# EAGLE design Pi_Servo_pHAT (EAGLE 9.4.2)
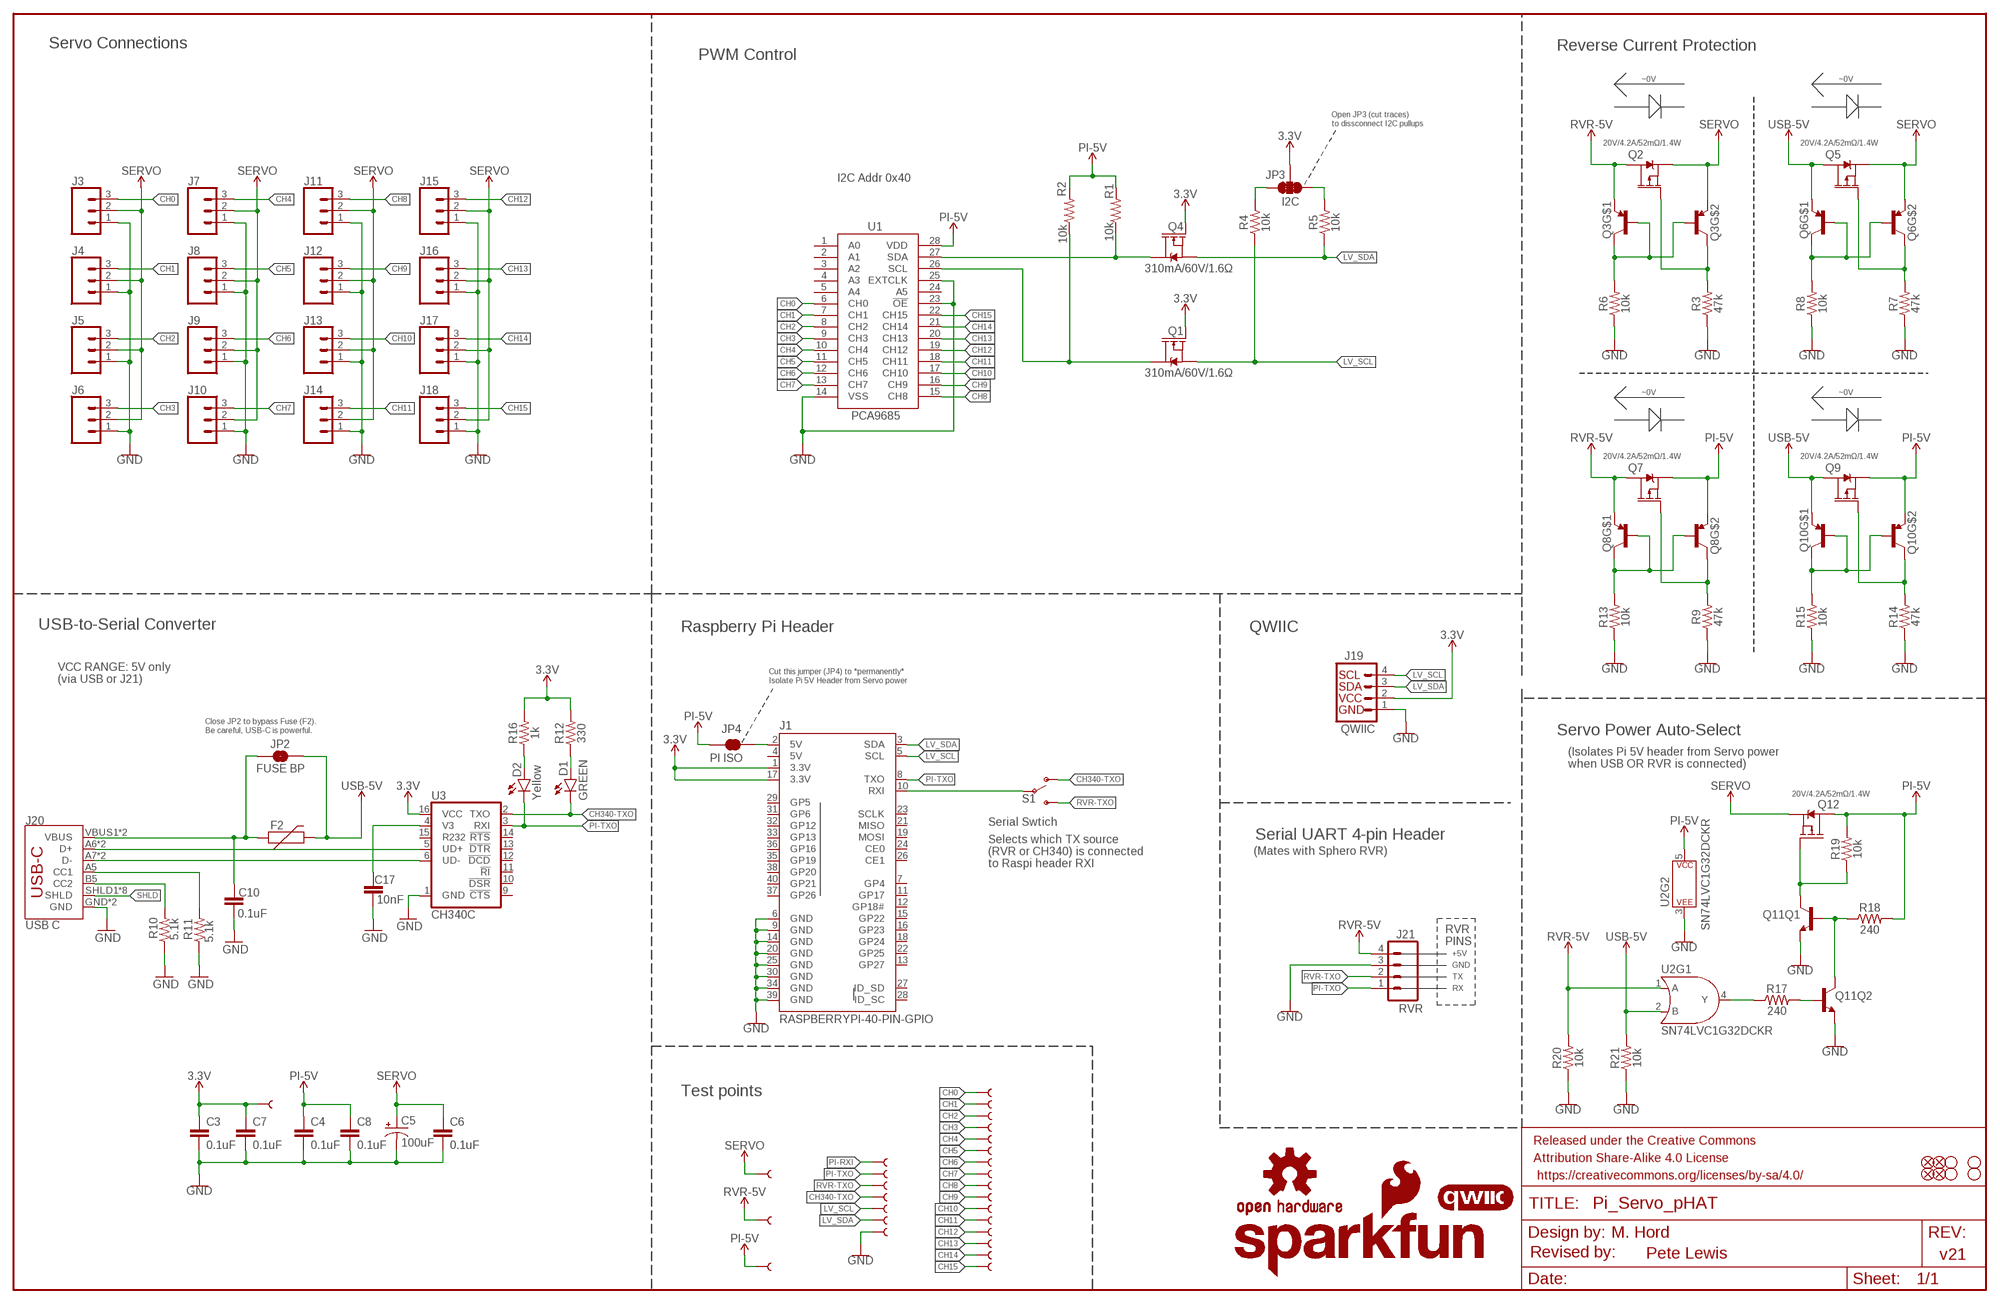
[diagram p0: schematic, sheet 1]

## Parts
C3  0.1uF  0.1UF-0603-25V-(+80/-20%)  [0603]
C4  0.1uF  0.1UF-0603-25V-(+80/-20%)  [0603]
C5  100uF  100UF-POLAR-25V-20%(ELEC)  [PANASONIC_D]
C6  0.1uF  0.1UF-0603-25V-(+80/-20%)  [0603]
C7  0.1uF  0.1UF-0603-25V-(+80/-20%)  [0603]
C8  0.1uF  0.1UF-0603-25V-(+80/-20%)  [0603]
C10  0.1uF  0.1UF-0603-25V-(+80/-20%)  [0603]
C17  10nF  10NF-0603-50V-10%  [0603]
D1  GREEN  LED-GREEN0603  [LED-0603]
D2  Yellow  LED-YELLOW0603  [LED-0603]
F2  16V/2.5A(5A TRIP)  PPTC_16V_2.5A  [1812]
FD1  FIDUCIALUFIDUCIAL  [FIDUCIAL-MICRO]
FD2  FIDUCIALUFIDUCIAL  [FIDUCIAL-MICRO]
FD3  FIDUCIALUFIDUCIAL  [FIDUCIAL-MICRO]
FD4  FIDUCIALUFIDUCIAL  [FIDUCIAL-MICRO]
FRAME2  FRAME-LEDGER  [CREATIVE_COMMONS]
H1  STAND-OFF  [STAND-OFF]
H2  STAND-OFF  [STAND-OFF]
H3  STAND-OFF  [STAND-OFF]
H4  STAND-OFF  [STAND-OFF]
J1  RASPBERRYPI-40-PIN-GPIO  RASPBERRYPI-40-PIN-GPIO_PTH_NO_SHROUD  [2X20]
J3  CONN_03  [1X03]
J4  CONN_03  [1X03]
J5  CONN_03  [1X03]
J6  CONN_03  [1X03]
J7  CONN_03  [1X03]
J8  CONN_03  [1X03]
J9  CONN_03  [1X03]
J10  CONN_03  [1X03]
J11  CONN_03  [1X03]
J12  CONN_03  [1X03]
J13  CONN_03  [1X03]
J14  CONN_03  [1X03]
J15  CONN_03  [1X03]
J16  CONN_03  [1X03]
J17  CONN_03  [1X03]
J18  CONN_03  [1X03]
J19  QWIIC  QWIIC_CONNECTORJS-1MM  [JST04_1MM_RA]
J20  USB C  USB_C16PIN  [USB-C-16P]
J21  RVR  CONN_04LOCK  [1X04_LOCK]
JP2  FUSE BP  JUMPER-SMT_2_NO_SILK  [SMT-JUMPER_2_NO_SILK]
JP3  I2C  JUMPER-SMT_3_2-NC_TRACE_SILK  [SMT-JUMPER_3_2-NC_TRACE_SILK]
JP4  PI ISO  JUMPER-SMT_2_NC_TRACE_SILK  [SMT-JUMPER_2_NC_TRACE_SILK]
LOGO1  SFE_LOGO_NAME_FLAME.1_INCH  [SFE_LOGO_NAME_FLAME_.1]
LOGO2  OSHW-LOGOS  [OSHW-LOGO-S]
Q1  310mA/60V/1.6Ω  MOSFET-NCH-2N7002PW  [SOT323]
Q2  20V/4.2A/52mΩ/1.4W  MOSFET_PCH-DMG2305UX-7  [SOT23-3]
Q3  TRANS_PNP_DUALSOT-363  [SOT363_PHILIPS]
Q4  310mA/60V/1.6Ω  MOSFET-NCH-2N7002PW  [SOT323]
Q5  20V/4.2A/52mΩ/1.4W  MOSFET_PCH-DMG2305UX-7  [SOT23-3]
Q6  TRANS_PNP_DUALSOT-363  [SOT363_PHILIPS]
Q7  20V/4.2A/52mΩ/1.4W  MOSFET_PCH-DMG2305UX-7  [SOT23-3]
Q8  TRANS_PNP_DUALSOT-363  [SOT363_PHILIPS]
Q9  20V/4.2A/52mΩ/1.4W  MOSFET_PCH-DMG2305UX-7  [SOT23-3]
Q10  TRANS_PNP_DUALSOT-363  [SOT363_PHILIPS]
Q11  TRANS_NPN_DUAL-MBT3904DW1T1  [SC70-6]
Q12  20V/4.2A/52mΩ/1.4W  MOSFET_PCH-DMG2305UX-7  [SOT23-3]
R1  10k  10KOHM-0603-1/10W-1%  [0603]
R2  10k  10KOHM-0603-1/10W-1%  [0603]
R3  47k  47KOHM-0603-1/10W-1%  [0603]
R4  10k  10KOHM-0603-1/10W-1%  [0603]
R5  10k  10KOHM-0603-1/10W-1%  [0603]
R6  10k  10KOHM-0603-1/10W-1%  [0603]
R7  47k  47KOHM-0603-1/10W-1%  [0603]
R8  10k  10KOHM-0603-1/10W-1%  [0603]
R9  47k  47KOHM-0603-1/10W-1%  [0603]
R10  5.1k  5.1KOHM5.1KOHM-0603-1/10W-1%  [0603]
R11  5.1k  5.1KOHM5.1KOHM-0603-1/10W-1%  [0603]
R12  330  330OHM-0603-1/10W-1%  [0603]
R13  10k  10KOHM-0603-1/10W-1%  [0603]
R14  47k  47KOHM-0603-1/10W-1%  [0603]
R15  10k  10KOHM-0603-1/10W-1%  [0603]
R16  1k  1KOHM-0603-1/10W-1%  [0603]
R17  240  240OHM-0603-1/10W-1%  [0603]
R18  240  240OHM-0603-1/10W-1%  [0603]
R19  10k  10KOHM-0603-1/10W-1%  [0603]
R20  10k  10KOHM-0603-1/10W-1%  [0603]
R21  10k  10KOHM-0603-1/10W-1%  [0603]
S1  SWITCH-SPDT-SMD-RIGHT-ANGLE  [SWITCH_SPST_SMD_A]
TP0  TEST-POINT3X4  [PAD.03X.04]
TP1  TEST-POINT3X4  [PAD.03X.04]
TP2  TEST-POINT3X4  [PAD.03X.04]
TP3  TEST-POINT3X4  [PAD.03X.04]
TP4  TEST-POINT3X4  [PAD.03X.04]
TP5  TEST-POINT3X4  [PAD.03X.04]
TP6  TEST-POINT3X4  [PAD.03X.04]
TP7  TEST-POINT3X4  [PAD.03X.04]
TP8  TEST-POINT3X4  [PAD.03X.04]
TP9  TEST-POINT3X4  [PAD.03X.04]
TP10  TEST-POINT3X4  [PAD.03X.04]
TP11  TEST-POINT3X4  [PAD.03X.04]
TP12  TEST-POINT3X4  [PAD.03X.04]
TP13  TEST-POINT3X4  [PAD.03X.04]
TP14  TEST-POINT3X4  [PAD.03X.04]
TP15  TEST-POINT3X4  [PAD.03X.04]
TP16  TEST-POINT3X4  [PAD.03X.04]
TP17  TEST-POINT3X4  [PAD.03X.04]
TP18  TEST-POINTTP_15TH_THRU  [TP_15TH]
TP19  TEST-POINTTP_15TH_THRU  [TP_15TH]
TP20  TEST-POINT3X4  [PAD.03X.04]
TP21  TEST-POINT3X4  [PAD.03X.04]
TP22  TEST-POINT3X4  [PAD.03X.04]
TP23  TEST-POINT3X4  [PAD.03X.04]
TP24  TEST-POINT3X4  [PAD.03X.04]
TP25  TEST-POINT3X4  [PAD.03X.04]
TP26  TEST-POINT3X4  [PAD.03X.04]
U1  PCA9685  [TSSOP-28_4MM]
U2  SN74LVC1G32DCKR  7432  [SOT353]
U3  CH340C  [SO016]
U$1  QWIIC_LOGO_5MM  [QWIIC_5MM]

## Nets
3.3V: C3.1 C7.1 J1.1(3.3V) J1.17(3.3V) J19.2 JP3.2 Q1.1(G) Q4.1(G) R12.2 R16.2 TP22.P$1 U3.16(VCC)
CC1: J20.A5(CC1) R11.2
CC2: J20.B5(CC2) R10.2
CH0: J3.3 TP0.P$1 U1.6(CH0)
CH1: J4.3 TP1.P$1 U1.7(CH1)
CH2: J5.3 TP2.P$1 U1.8(CH2)
CH3: J6.3 TP3.P$1 U1.9(CH3)
CH4: J7.3 TP4.P$1 U1.10(CH4)
CH5: J8.3 TP5.P$1 U1.11(CH5)
CH6: J9.3 TP6.P$1 U1.12(CH6)
CH7: J10.3 TP7.P$1 U1.13(CH7)
CH8: J11.3 TP8.P$1 U1.15(CH8)
CH9: J12.3 TP9.P$1 U1.16(CH9)
CH10: J13.3 TP10.P$1 U1.17(CH10)
CH11: J14.3 TP11.P$1 U1.18(CH11)
CH12: J15.3 TP12.P$1 U1.19(CH12)
CH13: J16.3 TP13.P$1 U1.20(CH13)
CH14: J17.3 TP14.P$1 U1.21(CH14)
CH15: J18.3 TP15.P$1 U1.22(CH15)
CH340-TXO: D1.C S1.1(O) TP23.P$1 U3.2(TXO)
D+: J20.A6(D+) J20.B6(D+) U3.5(UD+)
D-: J20.A7(D-) J20.B7(D-) U3.6(UD-)
GND: C3.2 C4.2 C5.- C6.2 C7.2 C8.2 C10.2 C17.2 J1.6(GND) J1.9(GND) J1.14(GND) J1.20(GND) J1.25(GND) J1.30(GND) J1.34(GND) J1.39(GND) J3.1 J4.1 J5.1 J6.1 J7.1 J8.1 J9.1 J10.1 J11.1 J12.1 J13.1 J14.1 J15.1 J16.1 J17.1 J18.1 J19.1 J20.GND J20.GND2(GND) J21.3 Q11.1(Q2:E) Q11.4(Q1:E) R3.1 R6.1 R7.1 R8.1 R9.1 R10.1 R11.1 R13.1 R14.1 R15.1 R20.1 R21.1 TP17.P$1 U1.14(VSS) U1.23(!OE) U1.25(EXTCLK) U2.3(P$V-) U3.1(GND)
LV_SCL: J1.5(SCL) J19.4 Q1.2(S) R4.1 TP18.P$1
LV_SDA: J1.3(SDA) J19.3 Q4.2(S) R5.1 TP19.P$1
N$1: Q5.1(G) Q6.3(C) R7.2
N$2: JP3.3 R4.2
N$3: Q1.3(D) R2.1 U1.26(SCL)
N$4: Q4.3(D) R1.1 U1.27(SDA)
N$5: JP3.1 R5.2
N$6: D2.A R16.1
N$7: D1.A R12.1
N$8: Q11.2(Q2:B) R17.2
N$9: Q2.1(G) Q3.3(C) R3.2
N$10: Q3.2(B) Q3.5(B) Q3.6(C) R6.2
N$11: Q6.2(B) Q6.5(B) Q6.6(C) R8.2
N$12: Q11.5(Q1:B) Q11.6(Q2:C) R18.1
N$13: Q11.3(Q1:C) Q12.1(G) R19.1
N$14: C17.1 U3.4(V3)
N$15: Q7.1(G) Q8.3(C) R9.2
N$16: Q8.2(B) Q8.5(B) Q8.6(C) R13.2
N$17: R17.1 U2.4(Y)
N$18: Q9.1(G) Q10.3(C) R14.2
N$19: Q10.2(B) Q10.5(B) Q10.6(C) R15.2
N$20: J1.2(5V) JP4.2
PI-5V: C4.1 C8.1 JP4.1 Q7.2(S) Q8.4(E) Q9.2(S) Q10.4(E) Q12.3(D) R1.2 R2.2 R18.2 R19.2 TP24.P$1 U1.28(VDD) U2.5(P$V+)
PI-RXI: J1.10(RXI) S1.2(P) TP26.P$1
PI-TXO: D2.C J1.8(TXO) J21.1 TP20.P$1 U3.3(RXI)
RVR-5V: J21.4 Q2.3(D) Q3.1(E) Q7.3(D) Q8.1(E) R20.2 TP25.P$1 U2.1(A)
RVR-TXO: J21.2 S1.3(S) TP21.P$1
SERVO: C5.+ C6.1 J3.2 J4.2 J5.2 J6.2 J7.2 J8.2 J9.2 J10.2 J11.2 J12.2 J13.2 J14.2 J15.2 J16.2 J17.2 J18.2 Q2.2(S) Q3.4(E) Q5.2(S) Q6.4(E) Q12.2(S) TP16.P$1
SHLD: J20.SHLD1(SHLD) J20.SHLD2(SHLD) J20.SHLD3(SHLD) J20.SHLD4(SHLD) J20.SHLD5(SHLD) J20.SHLD6(SHLD) J20.SHLD7(SHLD) J20.SHLD8(SHLD)
USB-5V: F2.2 JP2.2 Q5.3(D) Q6.1(E) Q9.3(D) Q10.1(E) R21.2 U2.2(B)
VBUS [power]: C10.1 F2.1 J20.VBUS1(VBUS) J20.VBUS2(VBUS) JP2.1
Unconnected: J1.7(GP4) J1.11(GP17) J1.12(GP18#) J1.13(GP27) J1.15(GP22) J1.16(GP23) J1.18(GP24) J1.19(MOSI) J1.21(MISO) J1.22(GP25) J1.23(SCLK) J1.24(CE0) J1.26(CE1) J1.27(ID_SD) J1.28(ID_SC) J1.29(GP5) J1.31(GP6) J1.32(GP12) J1.33(GP13) J1.35(GP19) J1.36(GP16) J1.37(GP26) J1.38(GP20) J1.40(GP21) U1.1(A0) U1.2(A1) U1.3(A2) U1.4(A3) U1.5(A4) U1.24(A5) U3.9(!CTS) U3.10(!DSR) U3.11(!RI) U3.12(!DCD) U3.13(!DTR) U3.14(!RTS) U3.15(R232)

## Notes on the sheet
- Servo Connections | Reverse Current Protection
- PWM Control
- ~0V | ~0V
- Open JP3 (cut traces)
  to dissconnect I2C pullups
- I2C Addr 0x40
- ~0V | ~0V
- USB-to-Serial Converter | Raspberry Pi Header | QWIIC
- VCC RANGE: 5V only
  (via USB or J21)
- Cut this jumper (JP4) to *permanently* 
  Isolate Pi 5V Header from Servo power
- Close JP2 to bypass Fuse (F2).
  Be careful, USB-C is powerful.
- Servo Power Auto-Select
- (Isolates Pi 5V header from Servo power
  when USB OR RVR is connected)
- Serial Swtich
- Selects which TX source 
  (RVR or CH340) is connected 
  to Raspi header RXI
- Serial UART 4-pin Header
- (Mates with Sphero RVR)
- RVR
  PINS
- +5V
- GND
- TX
- RX
- Test points
- M. Hord
- Revised by: | Pete Lewis | v21

## Power pins joined to a net without a drawn wire
5V: J1.4(5V)

## Library data of the parts
C3 C4 C6-C8 C10 = SparkFun-Capacitors:0.1UF: 0.1µF ceramic capacitors A capacitor is a passive two-terminal electrical component used to store electrical energy temporarily in an electric field.; PROD_ID: CAP-00810
C5 = SparkFun-Capacitors:100UF-POLAR: 100µF polarized capacitors A capacitor is a passive two-terminal electrical component used to store electrical energy temporarily in an electric field.; PROD_ID: CAP-12547
C17 = SparkFun-Capacitors:10NF: 0.01uF/10nF/10,000pF ceramic capacitors A capacitor is a passive two-terminal electrical component used to store electrical energy temporarily in an electric field. CAP-09321; PROD_ID: CAP-00867
D1 = SparkFun-LED:LED-GREEN: Green SMD LED Used in manufacturing of various products at SparkFun Packages: 0603 - SMD 0603 package [Product Link] <http://www.futureelectronics.com/en/technologies/semiconductors/optoelectronics/leds/Pages/9894312-LTST-C190GKT.aspx?CrossPart=HSMG-C190&IM=0> LilyPad 1206 - SMD1206 LilyPad package [Product Link] <http://www.futureelectronics.com/en/Technologies/Product.aspx?ProductID=IN150NGHARVATEKCORPORATION2049943&IM=0> 1206 - SMD1206 package [Product Link] <http://www.futureelectronics.com/en/technologies/semiconductors/optoelectronics/leds/Pages/8315665-LTST-C150KGKT.aspx?IM=0> 1206 Bottom Mount -SMD 1206 Bottom Mount [Product Link] <http://www.digikey.com/product-detail/en/lite-on-inc/LTST-C230KGKT/160-1456-1-ND/386854> SparkFun Products: Pro Mini 328 -5V <https://www.sparkfun.com/products/821> RedBoard <https://www.sparkfun.com/products/12757> MP3 Trigger <https://www.sparkfun.com/products/13720> Makey Makey <https://www.sparkfun.com/products/11076>; PROD_ID: DIO-00821
D2 = SparkFun-LED:LED-YELLOW: Yellow SMD LED Used in manufacturing several products at SparkFun. Packages: 0603 - SMD 0603 package[Product Link] <http://www.kingbrightusa.com/product.asp?catalog_name=LED&product_id=APT1608SYCK> 0603 -SMART - SMART SMD 0603 package (more efficient/more expensive) [Product Link] <http://www.osram-os.com/osram_os/en/products/product-catalog/led-light-emitting-diodes/smartled-0603/ly-l29k/index.jsp> LilyPad - SMD1206 package[Product Datasheet] <https://www.sparkfun.com/datasheets/DevTools/LilyPad/Q150YUS4.pdf> SparkFun Products: Blynk Board <https://www.sparkfun.com/products/13794> IOIO-OTG <https://www.sparkfun.com/products/13613> XBee Explorer Serial <https://www.sparkfun.com/products/13225>; PROD_ID: DIO-09003
F2 = SparkFun-Fuses:PPTC: Resettable Fuse PPTC Resettable Fuse. Really a sort of resistor with a polymeric positive temperature coefficient whose resistance increases dramatically with an increase in temperature. When heated by the power passing through the resistance rises causing the current to be limited, protecting the circuit. This is achieved by the transition of the polymer from a crystalline to an amorphous state where the conductive carbon separates breaking the conductive pathways found in the cool crystalline structure. When a PPTC cools back down it resumes conducting letting the circuit turn back on. SparkFun Products: SparkFun RedBoard - Programmed with Arduino Pro Micro - 5V/16MHz Arduino Pro 328 - 5V/16MHz MP3 Trigger; PROD_ID: RES-14390
FD1-FD4 = SparkFun-Aesthetics:FIDUCIAL: Fiducial Alignment Points Point-of-reference for pick-and-place machines and other optical instruments.
FRAME2 = SparkFun-Aesthetics:FRAME-LEDGER: Schematic Frame - Ledger Standard 11x14 US Ledger frame
H1-H4 = SparkFun-Hardware:STAND-OFF: Stand Off Drill holes for mechanically mounting via screws, standoffs, etc. Note: Use the keepout ring to avoid running the screw head into surrounding components. Variant Overviews STAND-OFF - Mechanical footprint for a #4 phillips button head screw. STAND-OFF-TIGHT - Mechanical footprint for a #4 phillips button head screw, Example SparkFun Products Screw - Phillips Head (1/4", 4-40, 10 pack) (PRT-10453) Screw - Phillips Head (1/2", 4-40, 10 pack) (PRT-10452) Screw - Phillips Head (3/4", 4-40, 10 pack) (PRT-10451) Screw - Phillips Head (1", 4-40, 10 pack) (PRT-10450)
J1 = SparkFun-Connectors:RASPBERRYPI-40-PIN-GPIO: Raspberry Pi GPIO Header 2x20 pin connector, as found on B, B+, A+ models. Both shrouded PTH and SMT versions available. SparkFun Products: GPIO Shrouded Header <https://www.sparkfun.com/products/13054>- PTH SparkFun Pi Wedge (Preassembled) <https://www.sparkfun.com/products/13717>
J3-J18 = SparkFun-Connectors:CONN_03: Multi connection point. Often used as Generic Header-pin footprint for 0.1 inch spaced/style header connections On any of the 0.1 inch spaced packages, you can populate with these: Break Away Headers - Straight (PRT-00116) Break Away Male Headers - Right Angle (PRT-00553) Female Headers (PRT-00115) Break Away Headers - Machine Pin (PRT-00117) Break Away Female Headers - Swiss Machine Pin (PRT-00743) Stackable Header - 3 Pin (Female, 0.1") (PRT-13875) For SCREWTERMINALS and SPRING TERMINALS visit here: Screw Terimnals on SparkFun.com (5mm/3.5mm/2.54mm spacing) This device is also useful as a general connection point to wire up your design to another part of your project. Our various solder wires solder well into these plated through hole pads. Hook-Up Wire - Assortment (Stranded, 22 AWG) (PRT-11375) Hook-Up Wire - Assortment (Solid Core, 22 AWG) (PRT-11367) View the entire wire category on our website here Special notes: Molex polarized connector foot print use with SKU : PRT-08232 with associated crimp pins and housings.; PROD_ID: XXX-00000; VALUE: 455-1750-1-ND
J19 = SparkFun-Connectors:QWIIC_CONNECTOR: SparkFun I2C Standard Qwiic Connector An SMD 1mm pitch JST connector makes it easy and quick (get it? Qwiic?) to connect I2C devices to each other. The Qwiic system <http://www.sparkfun.com/qwiic> enables fast and solderless connection between popular platforms and various sensors and actuators. We carry 200mm <https://www.sparkfun.com/products/14204>, 100mm <https://www.sparkfun.com/products/14205>, 50mm <https://www.sparkfun.com/products/14206>, and breadboard friendly <https://www.sparkfun.com/products/14207> Qwiic cables. We also offer 10 pcs strips <https://www.sparkfun.com/products/14323> the SMD connectors.; PROD_ID: CONN-13694
J20 = SparkFun-Connectors:USB_C: USB Type C 16Pin Connector Super Speed pins not available on the 16-pin purely SMD connector so this part is best for USB 2.0 implementations. D1 and D2 are tied together enabling D+/- no matter which way the cable is plugged into the connector. The two channel configuration pins (CC1/2) are exposed. These are normally connected to ground via 5.1k resistors but can be reconfigured for high current/high power applications.; PROD_ID: CONN-14122
J21 = SparkFun-Connectors:CONN_04: Multi connection point. Often used as Generic Header-pin footprint for 0.1 inch spaced/style header connections On any of the 0.1 inch spaced packages, you can populate with these: Break Away Headers - Straight (PRT-00116) Break Away Male Headers - Right Angle (PRT-00553) Female Headers (PRT-00115) Break Away Headers - Machine Pin (PRT-00117) Break Away Female Headers - Swiss Machine Pin (PRT-00743) For SCREWTERMINALS and SPRING TERMINALS visit here: Screw Terimnals on SparkFun.com (5mm/3.5mm/2.54mm spacing) This device is also useful as a general connection point to wire up your design to another part of your project. Our various solder wires solder well into these plated through hole pads. Hook-Up Wire - Assortment (Stranded, 22 AWG) (PRT-11375) Hook-Up Wire - Assortment (Solid Core, 22 AWG) (PRT-11367) View the entire wire category on our website here Special notes: Molex polarized connector foot print use with SKU : PRT-08231 with associated crimp pins and housings. 1MM SMD Version SKU: PRT-10208; PROD_ID: CONN-09696
JP2 = SparkFun-Jumpers:JUMPER-SMT_2_NO: Normally open jumper This jumper has two pads in close proximity to each other. Apply solder to close the connection. Round pads are easier to solder for beginners, but are a lot larger. SparkFun Product that uses the round pads: SparkFun EL Sequencer
JP3 = SparkFun-Jumpers:JUMPER-SMT_3_2-NC_TRACE: Normally closed trace jumper (2 of 2 connections) This jumper has a trace between all three pads so they are normally closed (NC). Use a razor knife to open the connection(s). For best results follow the IPC guidelines for cutting traces: Cutout at least 0.063 mm (0.005 in). Remove all loose material to clean up the cut area. Seal the cut with an approved epoxy. Reapply solder to reclose the connection(s).
JP4 = SparkFun-Jumpers:JUMPER-SMT_2_NC_TRACE: Normally closed trace jumper This jumper has a trace between two pads so it's normally closed (NC). Use a razor knife to open the connection. For best results follow the IPC guidelines for cutting traces: Cutout at least 0.063 mm (0.005 in). Remove all loose material to clean up the cut area. Seal the cut with an approved epoxy. Reapply solder to reclose the connection.
LOGO1 = SparkFun-Aesthetics:SFE_LOGO_NAME_FLAME: SparkFun Font Logo w/ Flame This is the SparkFun full logo. The logo on the schematic will always be the same size; the package variant is the height of the flame part of the logo. Default layer for the logo on the board is tSilk.
LOGO2 = SparkFun-Aesthetics:OSHW-LOGO: Open-Source Hardware (OSHW) Logo This logo indicates the piece of hardware it is found on incorporates a OSHW license and/or adheres to the definition of open source hardware found here: http://freedomdefined.org/OSHW
Q1 Q4 = SparkFun-DiscreteSemi:MOSFET-NCH: N-channel MOSFETs Voltage controlled devices that allow control of high current outputs. SparkFun Products: SparkFun OpenScale <https://www.sparkfun.com/products/13261> SparkFun Digital Sandbox <https://www.sparkfun.com/products/12651> SparkFun Monster Moto Shield <https://www.sparkfun.com/products/10182> SparkFun MOSFET Power Controller <https://www.sparkfun.com/products/11214>; PROD_ID: TRANS-11151
Q2 Q5 Q7 Q9 Q12 = SparkFun-DiscreteSemi:MOSFET_PCH: P-channel MOSFETs Voltage controlled devices that allow control of high current outputs. SparkFun Products: SparkFun ESP32 Thing <https://www.sparkfun.com/products/13907> SparkFun ESP8266 Thing <https://www.sparkfun.com/products/13231> SparkFun Pi Servo HAT V2 <https://www.sparkfun.com/products/15316> DMG2305UX-7 (20V/4.2A/SOT23-3); PROD_ID: TRAN-14388
Q3 Q6 Q8 Q10 = SparkFun-DiscreteSemi:TRANS_PNP_DUAL: Dual PNP Transistors in Single Package The BCM857BS puts two PNP transistors in a single package. Bipolar (BJT) Transistor Array 2 PNP (Dual) 45V 100mA 100MHz 200mW Surface Mount SOT-363 Datasheet <https://www.diodes.com/assets/Datasheets/BCM857BS.pdf> SparkFun Products: SparkFun Pi Servo HAT V2 <https://www.sparkfun.com>; PROD_ID: TRAN-14386
Q11 = SparkFun-DiscreteSemi:TRANS_NPN_DUAL: Dual NPN Transistors in Single Package The MBT3904W1 puts two general purpose 3904 NPN transistors in a single package. Datasheet <http://www.onsemi.com/pub_link/Collateral/MBT3904DW1T1-D.PDF> SparkFun Products: SparkFun ESP32 Thing <https://www.sparkfun.com/products/13907>; PROD_ID: TRANS-13337
R1 R2 R4-R6 R8 R13 R15 R19-R21 = SparkFun-Resistors:10KOHM: 10kΩ resistor A resistor is a passive two-terminal electrical component that implements electrical resistance as a circuit element. Resistors act to reduce current flow, and, at the same time, act to lower voltage levels within circuits. - Wikipedia; PROD_ID: RES-00824
R3 R7 R9 R14 = SparkFun-Resistors:47KOHM: 47kΩ resistor A resistor is a passive two-terminal electrical component that implements electrical resistance as a circuit element. Resistors act to reduce current flow, and, at the same time, act to lower voltage levels within circuits. - Wikipedia; PROD_ID: RES-07871
R10 R11 = SparkFun-Resistors:5.1KOHM; PROD_ID: RES-12083
R12 = SparkFun-Resistors:330OHM: 330Ω resistor A resistor is a passive two-terminal electrical component that implements electrical resistance as a circuit element. Resistors act to reduce current flow, and, at the same time, act to lower voltage levels within circuits. - Wikipedia; PROD_ID: RES-00818
R16 = SparkFun-Resistors:1KOHM: 1kΩ resistor A resistor is a passive two-terminal electrical component that implements electrical resistance as a circuit element. Resistors act to reduce current flow, and, at the same time, act to lower voltage levels within circuits. - Wikipedia; PROD_ID: RES-07856
R17 R18 = SparkFun-Resistors:240OHM: 240Ω resistor A resistor is a passive two-terminal electrical component that implements electrical resistance as a circuit element. Resistors act to reduce current flow, and, at the same time, act to lower voltage levels within circuits. - Wikipedia; PROD_ID: RES-07849
S1 = SparkFun-Switches:SWITCH-SPDT: Single Pole, Double Throw (SPDT) Switch Single-pole, double-throw (SPDT) switch. Variant Overview SMD-AYZ0202 Surface Mount DPDT Switch (COM-00597) Used on e.g. LilyPad Arduino USB - ATmega32U4 Board PTH-11.6X4.0MM SPDT Mini Power Switch (COM-00102) Used on e.g. SparkFun Simon Says - Through-Hole Soldering Kit (KIT-10547) PTH-11.6X4.0MM-KIT KIT version of SPDT Mini Power Switch - Simplifies soldering by removing tStop of switch pins - only one side can be soldered. PTH-11.6X4.0MM-LOCK LOCK version of SPDT Mini Power Switch - Offset pins hold switch in place for easier soldering. SMD-RIGHT-ANGLE Surface Mount Right Angle Switch (COM-10860) Used on e.g. SparkFun ESP8266 Thing; PROD_ID: SWCH-10651; SF_SKU: COM-10860
TP0 TP1-TP26 = SparkFun-Connectors:TEST-POINT: SparkFun Test Points Bare copper test points for troubleshooting or In-Circuit-Testing. These are used by our Production team for verifying production board runs using pogo-pins on test beds. SparkFun Products: SparkFun LSM9DS1 Breakout <https://www.sparkfun.com/products/13284> SparkFun PSOC <https://www.sparkfun.com/products/13714> SparkFun Load Cell Amplifier <https://www.sparkfun.com/products/13879>
U1 = SparkFun-IC-Special-Function:PCA9685: 16-channel 12-bit PWM I2C interface Internal Oscillator 40Hz to 1kHz Can be totem pole or open collector 2.3V to 5.5V SparkFun Products SparkFun Block for Intel® Edison - PWM (DEV-13042) PROTO: IC-12240 PROD_ID: IC-12271; PROD_ID: IC-12271
U2 = SparkFun-IC-Logic:74*32: Single OR gate IC POSITIVE-OR GATE 2-IN SC-70 SparkFun Products SparkFun Stepoko (ROB-13899) SparkFun LogicBlocks Kit (KIT-11006); PROD_ID: IC-10842
U3 = SparkFun-IC-Comms:CH340C; PROD_ID: IC-14038
U$1 = SparkFun-Aesthetics:QWIIC_LOGO: Qwiic Logos for placement on schematic and PCB. The 5.5mm silk logo is best for placing next to Qwiic connector.

## Net classes
1 power: width 0.508 mm

## Board
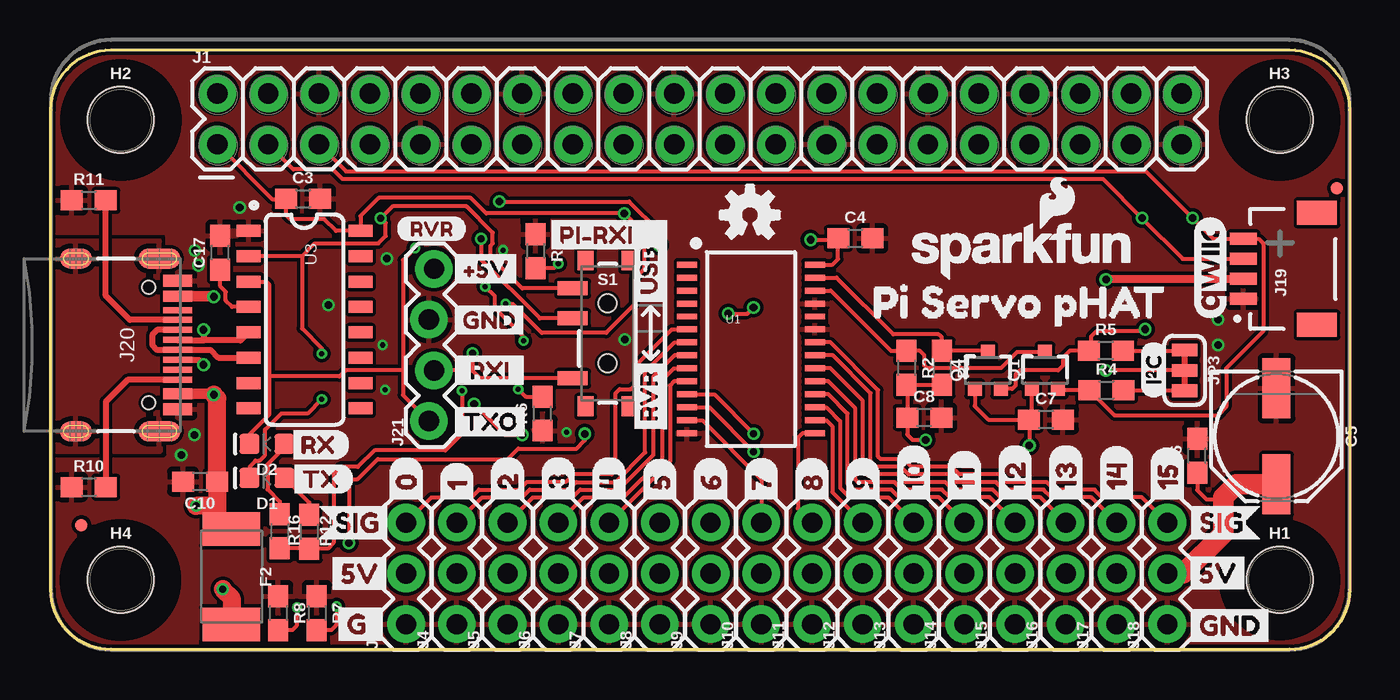
[diagram p1: board, top side]
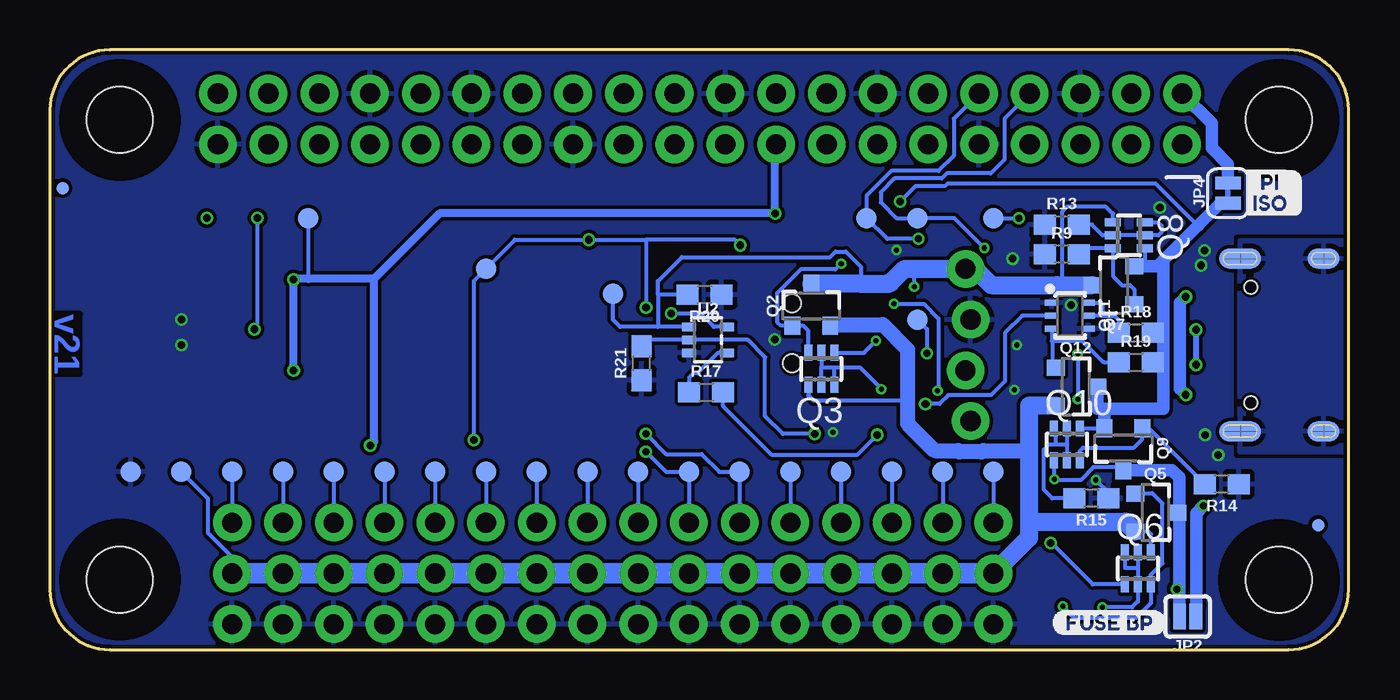
[diagram p2: board, bottom side, seen from below]

Size 65 x 30 mm. Coordinates in mm from the lower left corner, seen from the top.
Outline: 62,0 3,0 arc-90 0,3 0,27 arc-90 3,30 62,30 arc-90 65,27 65,3 arc-90 62,0
Copper layers (1*16): Top 0.035mm / dielectric 1.5mm / Bottom 0.035mm
Design rules "SparkFun-2-layer-FAB-LIMIT *": minimum track width 7mil, minimum drill 10mil, track to track 7mil, track to pad 7mil, pad to pad 7mil, via to via 7mil, smd to smd 4mil, copper to edge 7mil, drill to drill 7mil, minimum pad ring 5mil, minimum via ring 5mil, stop-mask expansion 4mil, vias tented up to drill 25mil, thermal gap 10mil

### Footprints (pad centres in the part's own frame; a part is rotated, then mirrored left to right if it is on the bottom)
0603 = smd 1.1 x 1: 1 -0.85,0; 2 0.85,0
PANASONIC_D = smd 3 x 1.4: + 2.4,0; - -2.4,0
LED-0603 = smd 1 x 1: A -0.877,0; C 0.877,0
1812 = smd 1.676 x 2.896: 1 -2.388,0; 2 2.388,0
FIDUCIAL-MICRO = smd 0.635 x 0.635: 1 0,0
STAND-OFF = hole 3.302: 0,0
2X20 = drill 1.016 pad 1.88: 1 0,0; 2 0,2.54; 3 2.54,0; 4 2.54,2.54; 5 5.08,0; 6 5.08,2.54; 7 7.62,0; 8 7.62,2.54; 9 10.16,0; 10 10.16,2.54; 11 12.7,0; 12 12.7,2.54; 13 15.24,0; 14 15.24,2.54; 15 17.78,0; 16 17.78,2.54; 17 20.32,0; 18 20.32,2.54; 19 22.86,0; 20 22.86,2.54; 21 25.4,0; 22 25.4,2.54; 23 27.94,0; 24 27.94,2.54; 25 30.48,0; 26 30.48,2.54; 27 33.02,0; 28 33.02,2.54; 29 35.56,0; 30 35.56,2.54; 31 38.1,0; 32 38.1,2.54; 33 40.64,0; 34 40.64,2.54; 35 43.18,0; 36 43.18,2.54; 37 45.72,0; 38 45.72,2.54; 39 48.26,0; 40 48.26,2.54
1X03 = drill 1.016 pad 1.88: 1 0,0; 2 2.54,0; 3 5.08,0
JST04_1MM_RA = smd 0.6 x 1.35: 1 -1.5,0; 2 -0.5,0; 3 0.5,0; 4 1.5,0 | smd 1.2 x 2: NC1 2.8,-3.675; NC2 -2.8,-3.675
USB-C-16P = smd 0.3 x 1.45: A5 -1.25,0; A6 -0.25,0; A7 0.25,0; A8 1.25,0; B5 1.75,0; B6 0.75,0; B7 -0.75,0; B8 -1.75,0 | smd 0.6 x 1.45: GND -3.225,0; GND2 3.225,0 | smd 1 x 2.1: SHLD1 -4.32,-0.915; SHLD2 4.32,-0.915 | smd 1 x 2.1 bottom: SHLD3 -4.32,-0.915; SHLD4 4.32,-0.915 | smd 1 x 1.6: SHLD5 -4.32,-5.095; SHLD8 4.32,-5.095 | smd 1 x 1.6 bottom: SHLD6 -4.32,-5.095; SHLD7 4.32,-5.095 | smd 0.55 x 1.45: VBUS1 -2.45,0; VBUS2 2.45,0 | hole 0.65: -2.89,-1.445; 2.89,-1.445
1X04_LOCK = drill 1.016 pad 1.88: 1 0,0.127; 2 2.54,-0.127; 3 5.08,0.127; 4 7.62,-0.127
SMT-JUMPER_2_NO_SILK = smd 0.635 x 1.27: 1 -0.406,0; 2 0.406,0
SMT-JUMPER_3_2-NC_TRACE_SILK = smd 0.635 x 1.27: 1 -1.016,0; 2 0,0; 3 1.016,0
SMT-JUMPER_2_NC_TRACE_SILK = smd 0.635 x 1.27: 1 -0.508,0; 2 0.508,0
SOT323 = smd 0.7 x 0.7: 1 -0.65,-0.925; 2 0.65,-0.925; 3 0,0.925
SOT23-3 = smd 0.8 x 0.9: 1 -0.95,-1; 2 0.95,-1; 3 0,1.1
SOT363_PHILIPS = smd 0.4 x 0.8: 1 -0.65,-0.8; 2 0,-0.8; 3 0.65,-0.8; 4 0.65,0.8; 5 0,0.8; 6 -0.65,0.8
SC70-6 = smd 0.3 x 0.66: 1 -0.65,-0.92; 2 0,-0.92; 3 0.65,-0.92; 4 0.65,0.92; 5 0,0.92; 6 -0.65,0.92
SWITCH_SPST_SMD_A = smd 0.7 x 1.5: 1 -2.25,-1.75; 2 -0.75,-1.75; 3 2.25,-1.75 | smd 1 x 0.6: GND1 -3.65,1; GND3 3.65,1 | smd 1 x 0.8: GND2 -3.65,-1.1; GND4 3.65,-1.1 | hole 0.9: -1.5,0; 1.5,0
PAD.03X.04 = smd 1.016 x 1.016: P$1 0,0
TP_15TH = drill 0.381 pad 0.61: P$1 0,0
TSSOP-28_4MM = smd 1 x 0.3: 1 -3.2,4.225; 2 -3.2,3.575; 3 -3.2,2.925; 4 -3.2,2.275; 5 -3.2,1.625; 6 -3.2,0.975; 7 -3.2,0.325; 8 -3.2,-0.325; 9 -3.2,-0.975; 10 -3.2,-1.625; 11 -3.2,-2.275; 12 -3.2,-2.925; 13 -3.2,-3.575; 14 -3.2,-4.225; 15 3.2,-4.225; 16 3.2,-3.575; 17 3.2,-2.925; 18 3.2,-2.275; 19 3.2,-1.625; 20 3.2,-0.975; 21 3.2,-0.325; 22 3.2,0.325; 23 3.2,0.975; 24 3.2,1.625; 25 3.2,2.275; 26 3.2,2.925; 27 3.2,3.575; 28 3.2,4.225
SOT353 = smd 0.42 x 0.7: 1 -0.65,-0.95; 2 0,-0.95; 3 0.65,-0.95; 4 0.65,0.95; 5 -0.65,0.95
SO016 = smd 0.6 x 1.2: 1 -4.445,-2.8; 2 -3.175,-2.8; 3 -1.905,-2.8; 4 -0.635,-2.8; 5 0.635,-2.8; 6 1.905,-2.8; 7 3.175,-2.8; 8 4.445,-2.8; 9 4.445,2.8; 10 3.175,2.8; 11 1.905,2.8; 12 0.635,2.8; 13 -0.635,2.8; 14 -1.905,2.8; 15 -3.175,2.8; 16 -4.445,2.8

### Placement (x,y rotation side)
C3  12.62,22.56 0 top
C4  40.26,20.57 0 top
C5  61.34,10.67 270 top
C6  57.37,9.69 90 top
C7  49.81,11.51 0 top
C8  43.71,11.61 0 top
C10  7.47,8.41 180 top
C17  8.48,19.86 90 top
D1  10.82,8.59 180 top
D2  10.82,10.29 180 top
F2  9.04,3.65 270 top
FD1  1.52,6.22 0 top
FD2  64.36,23.09 0 top
FD3  1.52,6.22 0 bottom
FD4  64.36,23.09 0 bottom
FRAME2  24.13,-20.32 0 top  (outside the outline)
H1  61.5,3.5 0 top
H2  3.5,26.5 0 top
H3  61.5,26.5 0 top
H4  3.5,3.5 0 top
J1  8.34,25.28 0 top
J3  17.78,1.27 90 top
J4  20.32,1.27 90 top
J5  22.86,1.27 90 top
J6  25.4,1.27 90 top
J7  27.94,1.27 90 top
J8  30.48,1.27 90 top
J9  33.02,1.27 90 top
J10  35.56,1.27 90 top
J11  38.1,1.27 90 top
J12  40.64,1.27 90 top
J13  43.18,1.27 90 top
J14  45.72,1.27 90 top
J15  48.26,1.27 90 top
J16  50.8,1.27 90 top
J17  53.34,1.27 90 top
J18  55.88,1.27 90 top
J19  59.69,19.05 90 top
J20  6.35,15.24 270 top
J21  19.05,11.43 90 top
JP2  8.06,1.65 180 bottom
JP3  56.74,13.97 270 top
JP4  6.05,22.83 90 bottom
LOGO1  48.64,19.95 0 top
LOGO2  34.99,21.74 0 top
Q1  49.76,13.97 0 top
Q2  26.9,17.2 0 bottom
Q3  26.39,14.05 180 bottom
Q4  46.89,13.97 0 top
Q5  9.68,6.86 270 bottom
Q6  10.54,4.06 0 bottom
Q7  11.73,18.24 90 bottom
Q8  11,20.73 270 bottom
Q9  11.28,10.08 180 bottom
Q10  14.1,10.26 0 bottom
Q11  13.94,16.71 270 bottom
Q12  13.67,13.16 270 bottom
R1  44.6,14.1 270 top
R2  42.82,14.1 270 top
R3  24.26,19.94 270 top
R4  52.83,12.98 0 top
R5  52.81,14.96 0 top
R6  24.61,11.81 90 top
R7  13.31,1.83 270 top
R8  11.38,1.83 270 top
R9  14.35,19.79 0 bottom
R10  1.91,8.13 0 top
R11  1.91,22.48 0 top
R12  12.93,5.89 270 top
R13  14.35,21.26 0 bottom
R14  6.35,8.28 180 bottom
R15  12.88,7.57 180 bottom
R16  11.46,5.92 270 top
R17  32.16,12.88 0 bottom
R18  10.64,15.85 0 bottom
R19  10.64,14.38 0 bottom
R20  32.23,17.75 180 bottom
R21  35.38,14.33 90 bottom
S1  27.87,15.82 270 top
TP0  17.78,8.89 270 bottom
TP1  20.32,8.89 270 bottom
TP2  22.86,8.89 270 bottom
TP3  25.4,8.89 270 bottom
TP4  27.94,8.89 270 bottom
TP5  30.48,8.89 270 bottom
TP6  33.02,8.89 270 bottom
TP7  35.56,8.89 270 bottom
TP8  38.1,8.89 270 bottom
TP9  40.64,8.89 270 bottom
TP10  43.18,8.89 270 bottom
TP11  45.72,8.89 270 bottom
TP12  48.26,8.89 270 bottom
TP13  50.8,8.89 270 bottom
TP14  53.34,8.89 270 bottom
TP15  55.88,8.89 270 bottom
TP16  58.42,8.89 0 bottom
TP17  60.96,8.89 0 bottom
TP18  57.15,21.59 0 top
TP19  54.61,21.59 0 top
TP20  21.59,21.59 180 bottom
TP21  21.59,16.51 180 bottom
TP22  52.07,21.59 0 bottom
TP23  17.78,21.59 0 bottom
TP24  43.18,19.05 0 bottom
TP25  36.83,17.81 0 bottom
TP26  24.13,21.59 0 bottom
U1  35.04,15.04 0 top
U2  32.05,15.49 270 bottom
U3  12.7,16.51 270 top
U$1  58.01,19.08 90 top
U$2  [I_SUPER2_C-()-03]  55.19,12.57 90 top
U$3  [028]  17.78,7.05 90 top
U$4  [129]  20.32,7.05 90 top
U$5  [230]  22.86,7.05 90 top
U$6  [331]  25.4,7.05 90 top
U$7  [432]  27.94,7.05 90 top
U$8  [533]  30.48,7.05 90 top
U$9  [634]  33.02,7.05 90 top
U$10  [735]  35.56,7.05 90 top
U$11  [836]  38.1,7.05 90 top
U$12  [937]  40.64,7.05 90 top
U$13  [1038]  43.18,7.05 90 top
U$14  [1139]  45.72,7.05 90 top
U$15  [1240]  48.26,7.05 90 top
U$16  [1341]  50.8,7.05 90 top
U$17  [1442]  53.34,7.05 90 top
U$18  [1543]  55.88,7.05 90 top
U$20  [5V5]  13.59,3.81 0 top
U$21  [SIG2]  13.32,6.35 0 top
U$22  [SIG3]  56.58,6.35 0 top
U$23  [GND25]  56.58,1.21 0 top
U$24  [5V5]  56.54,3.84 0 top
U$25  [TXO0]  19.79,11.4 0 top
U$26  [PI#RXI2]  24.64,20.75 0 top
U$27  [#5V3]  19.81,19.05 0 top
U$28  [GND2]  19.81,16.48 0 top
U$30  [RASP_μPI_HAT_SPECIFICATION]  31.75,12.7 0 top
U$31  [RVR1]  29.92,10.62 90 top
U$32  [ISO1]  5.49,22.34 0 bottom
U$33  [_RXI_0]  19.84,13.97 0 top
U$34  [USB0]  29.92,16.94 90 top
U$35  [PI0]  5.11,23.39 0 bottom
U$36  [RX0]  11.69,10.25 0 top
U$37  [TX1]  11.78,8.54 0 top
U$38  [RVR0]  17.3,21.06 0 top
U$39  [FUSE_BP0]  14.88,1.35 0 bottom
U$40  [G_0]  13.92,1.27 0 top
U$41  [PI_SERVO_PHAT0]  39.75,17.4 0 top

### Tracks (layer width: path | path; a pad name or v marks a point on that pad's centre or on a via)
3.3V  (via drill 0.25, 0.38)
  Top 0.203: J19.2 59.66,18.52 | JP3.2 v52.81,13.97 | C7.1 48.97,11.49 v48.97,10.21 | C7.1 49.11,11.65 Q1.1 | Q4.1 46.24,12.18 46.91,11.51 C7.1 | v22.76,17.3 23.11,17.3 24.56,15.85 27.79,15.85 29.21,17.27 29.21,18.54 29.72,19.05 29.72,20.8 v28.7,21.82 21.79,21.82 21.01,22.61 16.41,22.61 15.5,21.7 U3.16 14.28,20.95 13.69,21.54 11.99,21.54 11.79,21.74 11.79,22.54 | R16.2 12.9,5.07 R12.2 12.94,5.05 13.87,5.05 14.15,5.33 14.15,8.8 14.49,9.14 15.36,9.14 16.19,9.97 19.75,9.97 20.57,10.79 v20.57,12.95 | 11.79,22.54 C3.1 | 11.79,22.54 11.08,22.54 J1.1
  Top 0.406: 59.66,18.52 v52.81,18.52
  Bottom 0.203: TP22.P$1 52.07,18.54 | v22.76,17.3 21.26,17.3 20.53,16.56 20.53,12.97 20.55,12.95 v20.57,12.95
  Bottom 0.406: 48.77,18.54 52.07,18.54 52.81,18.54 v52.81,18.52 v52.81,13.97 | v48.97,10.21 48.77,10.41 48.77,18.54 | J1.17 28.7,25.24 v28.7,21.82 45.49,21.82 48.77,18.54
CC1
  Top 0.305: J20.A5 3.96,16.49 2.75,17.69 R11.2
CC2
  Top 0.305: J20.B5 3.84,13.49 2.75,12.41 R10.2
CH0
  Top 0.203: J3.3 19.05,7.62 21.05,7.62 21.43,8 23.43,8 23.81,8.38 25.75,8.38 26.13,8.76 28.07,8.76 28.26,8.96 28.26,12.82 28.47,13.03 29.03,13.03 29.36,13.36 29.36,14.3 31.08,16.02 U1.6
  Bottom 0.203: TP0.P$1 J3.3
CH1
  Top 0.203: J4.3 21.59,7.62 23.59,7.62 23.97,8 25.91,8 26.29,8.38 28.26,8.38 29.74,9.87 29.74,13.89 31.22,15.37 U1.7
  Bottom 0.203: TP1.P$1 J4.3
CH2
  Top 0.203: J5.3 24.13,7.62 26.11,7.62 26.49,8 28.42,8 30.15,9.73 30.15,13.64 31.23,14.71 U1.8
  Bottom 0.203: TP2.P$1 J5.3
CH3
  Top 0.203: J6.3 26.67,7.62 28.67,7.62 30.61,9.56 30.61,13.49 31.18,14.06 U1.9
  Bottom 0.203: TP3.P$1 J6.3
CH4
  Top 0.203: U1.10 31.2,13.41 30.99,13.21 30.99,9.4 J7.3
  Bottom 0.203: TP4.P$1 J7.3
CH5  (via drill 0.35)
  Top 0.203: U1.11 33.21,12.77 v35.18,10.79
  Bottom 0.203: J8.3 TP5.P$1 31.5,8.89 32.38,9.78 34.16,9.78 v35.18,10.79
CH6  (via drill 0.35)
  Top 0.203: U1.12 32.97,12.12 v35.18,9.91
  Bottom 0.203: J9.3 TP6.P$1 34.16,8.89 v35.18,9.91
CH7
  Top 0.203: U1.13 32.6,11.46 35.56,8.51 J10.3
  Bottom 0.203: TP7.P$1 J10.3
CH8
  Top 0.203: U1.15 37.61,10.81 37.39,10.59 37.39,7.06 J11.3
  Bottom 0.203: TP8.P$1 J11.3
CH9
  Top 0.203: U1.16 38.83,11.46 39.12,11.18 39.12,7.87 J12.3
  Bottom 0.203: TP9.P$1 J12.3
CH10
  Top 0.203: U1.17 38.81,12.12 39.5,11.43 39.5,8.1 39.98,7.62 41.91,7.62 J13.3
  Bottom 0.203: TP10.P$1 J13.3
CH11
  Top 0.203: J14.3 44.45,7.62 42.45,7.62 42.07,8 40.16,8 39.88,8.29 39.88,11.81 38.92,12.77 U1.18
  Bottom 0.203: TP11.P$1 J14.3
CH12
  Top 0.203: J15.3 46.99,7.62 44.99,7.62 44.61,8 42.61,8 42.23,8.38 40.4,8.38 40.26,8.52 40.26,12.06 38.91,13.41 U1.19
  Bottom 0.203: TP12.P$1 J15.3
CH13
  Top 0.203: J16.3 49.53,7.62 47.53,7.62 47.15,8 45.15,8 44.77,8.38 42.76,8.38 42.38,8.76 40.83,8.76 40.64,8.96 40.64,12.45 39.02,14.06 U1.20
  Bottom 0.203: TP13.P$1 J16.3
CH14
  Top 0.203: J17.3 52.07,7.62 50.07,7.62 49.69,8 47.69,8 47.31,8.38 45.3,8.38 44.92,8.76 42.92,8.76 42.54,9.14 41.15,9.14 41.02,9.27 41.02,12.83 39.13,14.71 U1.21
  Bottom 0.203: TP14.P$1 J17.3
CH15
  Top 0.203: J18.3 54.61,7.62 52.61,7.62 52.23,8 50.23,8 49.85,8.38 47.84,8.38 47.46,8.76 45.46,8.76 45.08,9.14 43.08,9.14 42.7,9.53 41.53,9.53 41.4,9.66 41.4,12.98 39.02,15.37 U1.22
  Bottom 0.203: TP15.P$1 J18.3
CH340-TXO  (via drill 0.25, 0.35)
  Top 0.203: U3.2 9.93,19.71 9.95,19.68 12.57,19.68 | 12.57,19.68 13.21,20.32 16.38,20.32 16.76,20.7 16.76,21.34 v16.51,21.59 17.09,22.17 20.8,22.17 22.12,20.86 22.12,20.31 22,20.18 22,19.66 23.59,18.07 S1.1 | 12.57,19.68 12.57,16.07 13.56,15.07 v13.56,14.81 | v13.56,12.52 12.85,11.81 11.53,11.81 10.72,11 10.72,9.73 10.44,9.45 10.25,9.45 9.97,9.17 9.97,8.61 D1.C
  Bottom 0.203: v13.56,14.81 v13.56,12.52 | TP23.P$1 v16.51,21.59
D+  (via drill 0.38)
  Top 0.305: J20.A6 6.37,15.47 7.64,15.47 | U3.5 9.5,15.47 7.64,15.47 | J20.B6 7.41,14.49 v7.64,14.25 | v7.64,16 7.64,15.47
  Bottom 0.305: v7.64,16 v7.64,14.25
D-
  Top 0.305: U3.6 8.38,14.61 8,14.99 J20.A7 5.34,14.99 5.33,14.99 5.08,15.24 5.08,15.75 5.32,15.99 J20.B7
GND  (via drill 0.25, 0.38)
  Bottom 0.203: v12.65,8.48 12.03,7.86 R15.1
  other vias: 58.42,16.51 58.42,15.24 7.21,19.96 7.39,19.23 7.19,10.74 6.53,9.73 13.89,17.25 28.73,15.52 9.45,22.12 16.81,19.56 16.74,13 16.61,15.24 25.81,10.87 22.63,19.99
  pour Top (rank 2): 0,30 65,30 65,0 0,0
  pour Bottom (rank 2): 0,30 65,30 65,0 0,0
LV_SCL
  Top 0.203: J1.5 14.77,23.93 54.81,23.93 TP18.P$1 58.19,20.55 J19.4 60.45,20.55 60.68,20.32 60.68,15.93 58.83,14.07 58.83,12.14 58.4,11.71 53.25,11.71 R4.1 50.47,12.98 Q1.2
LV_SDA  (via drill 0.38)
  Top 0.203: J1.3 12.13,24.03 14.1,24.03 14.58,23.55 52.65,23.55 TP19.P$1 56.65,19.55 J19.3 | Q4.2 48.12,13.04 48.28,13.21 48.28,13.77 48.49,13.97 50.42,13.97 50.65,14.2 50.65,14.61 51,14.96 R5.1 52.07,15.07 52.07,15.67 52.32,15.93 54.66,15.93 v54.76,16.03
  Bottom 0.203: v54.76,16.03 54.61,16.18 TP19.P$1
N$1  (via drill 0.25)
  Top 0.203: v14.3,2.16 14.3,1.25 14.03,0.98 R7.2
  Bottom 0.203: Q5.1 9.85,7.81 9.83,7.82 9.32,7.32 9.32,4.32 9.89,3.75 Q6.3 9.89,2.33 10.64,1.57 13.72,1.57 v14.3,2.16
N$2
  Top 0.203: R4.2 56.72,12.98 JP3.3
N$3
  Top 0.203: U1.26 39.03,17.96 42.05,14.95 R2.1 43.5,14.95 43.71,14.73 43.71,14.22 43.84,14.1 47.57,14.1 48.37,14.89 Q1.3
N$4
  Top 0.203: U1.27 39.32,18.61 42.16,15.78 44.45,15.78 44.58,15.65 44.58,14.97 R1.1 46.84,14.95 Q4.3
N$5
  Top 0.203: R5.2 56.72,14.96 JP3.1
N$6
  Top 0.203: D2.A 11.7,10.12 10.84,9.27 10.84,8.01 11.46,7.4 R16.1
N$7
  Top 0.203: R12.1 12.93,7.35 D1.A
N$8  (via drill 0.38)
  Top 0.203: v21.18,12.29 22.73,10.74 v23.6,10.74
  Bottom 0.203: Q11.2 16.33,16.71 17.2,15.85 17.2,13.44 17.91,12.72 20.04,12.72 20.47,12.29 v21.18,12.29 | v23.6,10.74 24.61,9.73 28.85,9.73 31.31,12.18 R17.2
N$9  (via drill 0.25)
  Top 0.203: v25.4,19.3 25.18,19.09 R3.2
  Bottom 0.203: v25.4,19.3 v25.41,19.3 25.69,19.02 27.41,19.02 28.6,17.84 28.6,16.38 28.45,16.23 27.88,16.23 Q2.1 27.3,16.2 27.04,15.94 Q3.3
N$10  (via drill 0.25)
  Top 0.203: v23.39,13.03 23.76,12.66 R6.2
  Bottom 0.203: Q3.6 25.74,14.12 | v23.39,13.03 23.39,13.06 24.46,14.12 25.74,14.12 | Q3.2 26.39,14.12 | 26.39,14.12 25.74,14.12 | Q3.5 26.39,14.12
N$11  (via drill 0.25)
  Top 0.203: R8.2 12.08,0.98 12.32,1.22 v12.32,2.11
  Bottom 0.203: Q6.5 10.54,4.09 | 10.54,4.09 Q6.2 10.54,2.41 10.85,2.11 v12.32,2.11 | Q6.6 11.2,4.85 11.2,4.09 10.54,4.09
N$12
  Bottom 0.203: 12.32,16.71 Q11.5 | Q11.6 12.44,17.36 12.32,17.25 12.32,16.71 | 12.32,16.71 11.73,16.71 11.49,16.47 R18.1
N$13
  Bottom 0.203: Q11.3 14.87,15.44 14.84,15.44 | 14.84,15.44 14.84,14.11 Q12.1 | 14.84,15.44 13.34,15.44 12.28,14.38 R19.1
N$14
  Top 0.203: U3.4 9.07,17.14 8.75,17.46 8.75,17.9 8.48,18.17 C17.1
N$15
  Bottom 0.203: Q7.1 10.73,18.02 10.95,18.24 11.35,18.24 11.8,18.68 Q8.3 13.21,20.08 R9.2
N$16
  Bottom 0.203: R13.2 12.85,21.26 12.32,20.73 Q8.2 Q8.5 9.53,20.73 9.37,20.88 9.37,21.21 9.54,21.38 Q8.6
N$17
  Bottom 0.203: R17.1 33.01,13.6 32.79,13.82 32.59,13.82 31.56,14.84 U2.4
N$18
  Bottom 0.203: Q10.3 13.45,9.95 13.28,10.11 10.74,10.11 10.33,10.53 Q9.1 10,11.08 R14.2
N$19
  Bottom 0.203: Q10.5 14.1,10.26 | 14.1,10.26 Q10.2 | 14.68,10.26 15.01,10.26 15.27,10.01 15.27,8 14.83,7.57 R15.2 | 14.68,10.26 14.1,10.26 | Q10.6 14.68,11 14.68,10.26
N$20
  Bottom 0.203: 6.04,23.53 JP4.2
  Bottom 0.635: J1.2 6.86,26.34 6.86,25.1 6.04,24.29 6.04,23.53
PI-5V  (via drill 0.38)
  Top 0.203: v38.02,20.51 39.34,20.51 C4.1 39.4,20.56 39.4,19.53 39.13,19.27 U1.28 | R1.2 R2.2 42.86,13.21 C8.1 42.86,10.76 43.13,10.49 v43.79,10.49 | v33.91,16.82 34.86,16.82 v35.17,17.12 | v30.45,20.23 30.45,20.91 28.95,22.42 v22.45,22.42
  Bottom 0.178: 12.56,12.04 12.23,12.04
  Bottom 0.203: Q10.4 12.25,11.06 Q9.2 | 35.17,20.51 v38.02,20.51 41.72,20.51 TP24.P$1 43.79,18.44 v43.79,10.49 | 35.17,20.51 35.14,20.51 35.14,20.52 30.75,20.52 v30.45,20.23 | Q8.4 10.2,19.2 10.21,19.19 | 7.52,21.23 7.57,21.23 9.65,23.32 20.08,23.32 20.21,23.19 21.68,23.19 v22.45,22.42 | U2.5 31.77,16.14 32.44,16.82 v33.91,16.82 | 35.17,20.51 v35.17,17.12 | R18.2 9.28,15.85 | R19.2 9.77,14.4 9.28,14.4
  Bottom 0.635: JP4.1 6.43,22.33 7.52,21.23 9.28,19.47 | 9.28,19.47 9.28,15.85 9.28,14.4 9.28,12.04 12.23,12.04 Q9.2 | 9.28,19.47 9.57,19.19 10.21,19.19 Q7.2 | Q12.3 12.56,12.04
PI-RXI  (via drill 0.35)
  Top 0.203: S1.2 24.48,16.57 21.54,19.51 v21.54,20.55
  Bottom 0.203: J1.10 19.76,26.56 19.76,24.71 20.52,23.95 22.89,23.95 24.13,22.71 TP26.P$1 23.09,20.55 v21.54,20.55
PI-TXO  (via drill 0.25)
  Top 0.203: U3.3 10.79,18.41 10.92,18.29 10.92,13.69 | D2.C 9.94,10.77 10.92,11.75 10.92,13.69 | 17.63,13.97 14.76,13.97 14.45,13.66 10.95,13.66 10.92,13.69 | v18.24,20.09 17.63,19.48 17.63,13.97 | 17.63,13.97 17.63,12.72 J21.1
  Bottom 0.203: J1.8 17.22,26.56 17.22,24.51 17.91,23.82 20.11,23.82 20.36,23.57 22.73,23.57 23.42,22.88 23.42,22.38 22.63,21.59 TP20.P$1 19.74,21.59 v18.24,20.09
RVR-5V  (via drill 0.25)
  Top 0.203: v21.74,18.16 22.23,17.68 22.23,17.08 23.65,15.65 v23.65,15.44
  Bottom 0.203: Q8.1 11.8,21.81 12.14,22.15 14.1,22.15 14.35,21.89 14.35,18.49 14.61,18.24 | 24.41,18.3 24.41,19.15 25.17,19.91 25.68,19.91 25.96,19.63 33.38,19.63 34.57,18.44 34.57,17.75 | 23.04,18.35 23.04,18.3 | R20.2 34.57,17.75 | TP25.P$1 36.83,16.51 36.46,16.14 34.57,16.14 | U2.1 34.57,16.14 | 34.57,17.75 34.57,16.14 | Q3.1 24.25,14.85 v23.65,15.44 | v21.74,18.16 21.74,18.9 21.59,19.05
  Bottom 0.889: Q7.3 14.61,18.24 17.88,18.24 18.69,19.05 J21.4 21.59,19.05 22.23,19.05 22.93,18.35 23.04,18.35 | 23.04,18.3 24.41,18.3 Q2.3
RVR-TXO  (via drill 0.35)
  Top 0.203: 21.11,13.95 21.08,13.97 J21.2 | S1.3 21.48,13.57 21.21,13.84 21.11,13.95 | v21.11,14.83 21.11,13.95
  Bottom 0.203: TP21.P$1 21.11,16.03 v21.11,14.83
SERVO
  Top 0.203: C6.1 57.37,7.98 57.84,7.52 58.67,7.52
  Top 1.016: J18.2 56.69,3.81 58.67,5.79 58.67,7.52 58.67,7.62 59.32,8.27 C5.+
  Bottom 0.203: J18.2 55.88,4.63 57.1,5.84 57.1,7.57 TP16.P$1 | 22.07,12.47 26.8,12.47 27.04,12.71 Q3.4 | Q2.2 25.89,16.26 | Q6.4 9.89,5.78 10.02,5.91 Q5.2
  Bottom 0.762: 25.89,16.26 23.32,16.26 22.07,15.01 22.07,12.47 22.07,11.3 20.73,9.96 19.55,9.96 19.49,9.89 18.36,9.89 18.3,9.96 16,9.96
  Bottom 0.889: 16,6.15 15.75,6.4 11.17,6.4 Q5.2 | 16,6.15 16,5.59 J3.2 | Q12.2 16,12.21 16,9.96 16,6.15
  Bottom 1.016: J18.2 J17.2 J16.2 J15.2 J14.2 J13.2 J12.2 J11.2 J10.2 J9.2 J8.2 J7.2 J6.2 J5.2 J4.2 J3.2
SHLD
  pour Top: 0,20.45 5.46,20.45 5.46,9.91 0,9.91
  pour Bottom: 0,20.45 5.46,20.45 5.46,9.91 0,9.91
USB-5V  (via drill 0.25, 0.35, 0.38)
  Top 0.203: v14.91,5.33 14.94,5.36 14.94,8.32 v14.73,8.53 15.36,8.53 16.36,9.53 22.86,9.53 23.39,10.06 26.31,10.06 26.72,10.46 v26.72,10.79
  Top 0.889: v8.61,3.02 9.04,2.59 F2.2
  Bottom 0.203: v26.72,10.79 28.32,10.79 29.21,11.68 29.21,14.63 30.07,15.49 U2.2 35.06,15.49 R21.2 | Q9.3 11.44,9.14 12.75,9.14 13.41,8.48 14.69,8.48 v14.73,8.53 14.75,8.54 Q10.1 | v14.91,5.33 14.88,5.33 12.81,3.26 Q6.1 | Q5.3 8.58,7.58 8.48,7.67
  Bottom 0.635: Q9.3 8.86,8.98 8.48,8.61 8.48,7.67 8.48,3.02 | 8.48,3.02 v8.61,3.02 | 8.48,3.02 8.48,2.97 8.47,2.95 JP2.2
VBUS  (via drill 0.35, 0.38)
  Top 0.508: F2.1 8.24,6.04 8.24,6.83 8.24,7.19
  Top 0.533: v8.15,17.65 8.12,17.69 J20.VBUS1 | J20.VBUS2 8.11,12.79 v8.15,12.75 8.33,12.57
  Top 0.889: 8.33,12.57 8.33,8.39 C10.1 8.32,6.83 8.24,6.83 | v8.15,12.75 | 8.24,7.19 v7.26,7.19
  Bottom 0.508: JP2.1 7.65,2.18 7.62,2.21
  Bottom 0.635: v8.15,17.65 8.46,17.35 8.46,13.06 v8.15,12.75 | v7.26,7.19 7.62,6.83 7.62,2.21

### Text on the board
Bottom: v21
tDocu: M. Hord | Revised by: | Pete Lewis